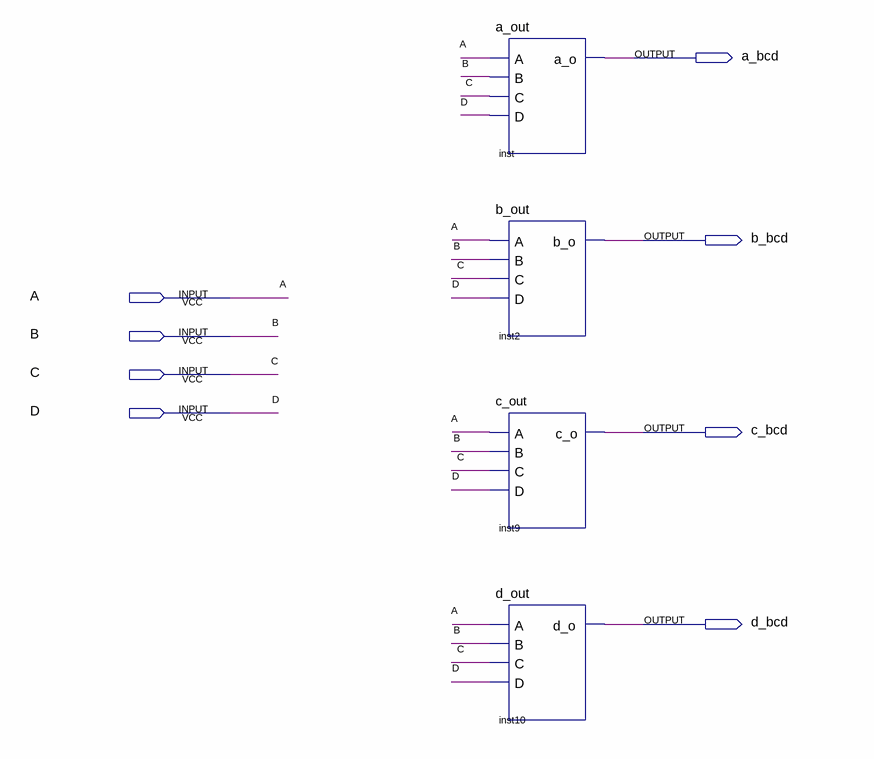
[diagram p0: schematic sheet]
// Quartus schematic comb_output.bdf as structural Verilog: 4 symbols, 8 pins
module comb_output (
  input  A,
  input  B,
  input  C,
  input  D,
  output a_bcd,
  output b_bcd,
  output c_bcd,
  output d_bcd
);

  a_out inst (.A(A), .B(B), .C(C), .D(D), .a_o(a_bcd));
  b_out inst2 (.A(A), .B(B), .C(C), .D(D), .b_o(b_bcd));
  c_out inst9 (.A(A), .B(B), .C(C), .D(D), .c_o(c_bcd));
  d_out inst10 (.A(A), .B(B), .C(C), .D(D), .d_o(d_bcd));
endmodule
